# EasyEDA schematic 0004.json
TITLE: Sheet_1; REV: 1.0; Date: 2021-01-05; Sheet: 1/1; Company: Your Company
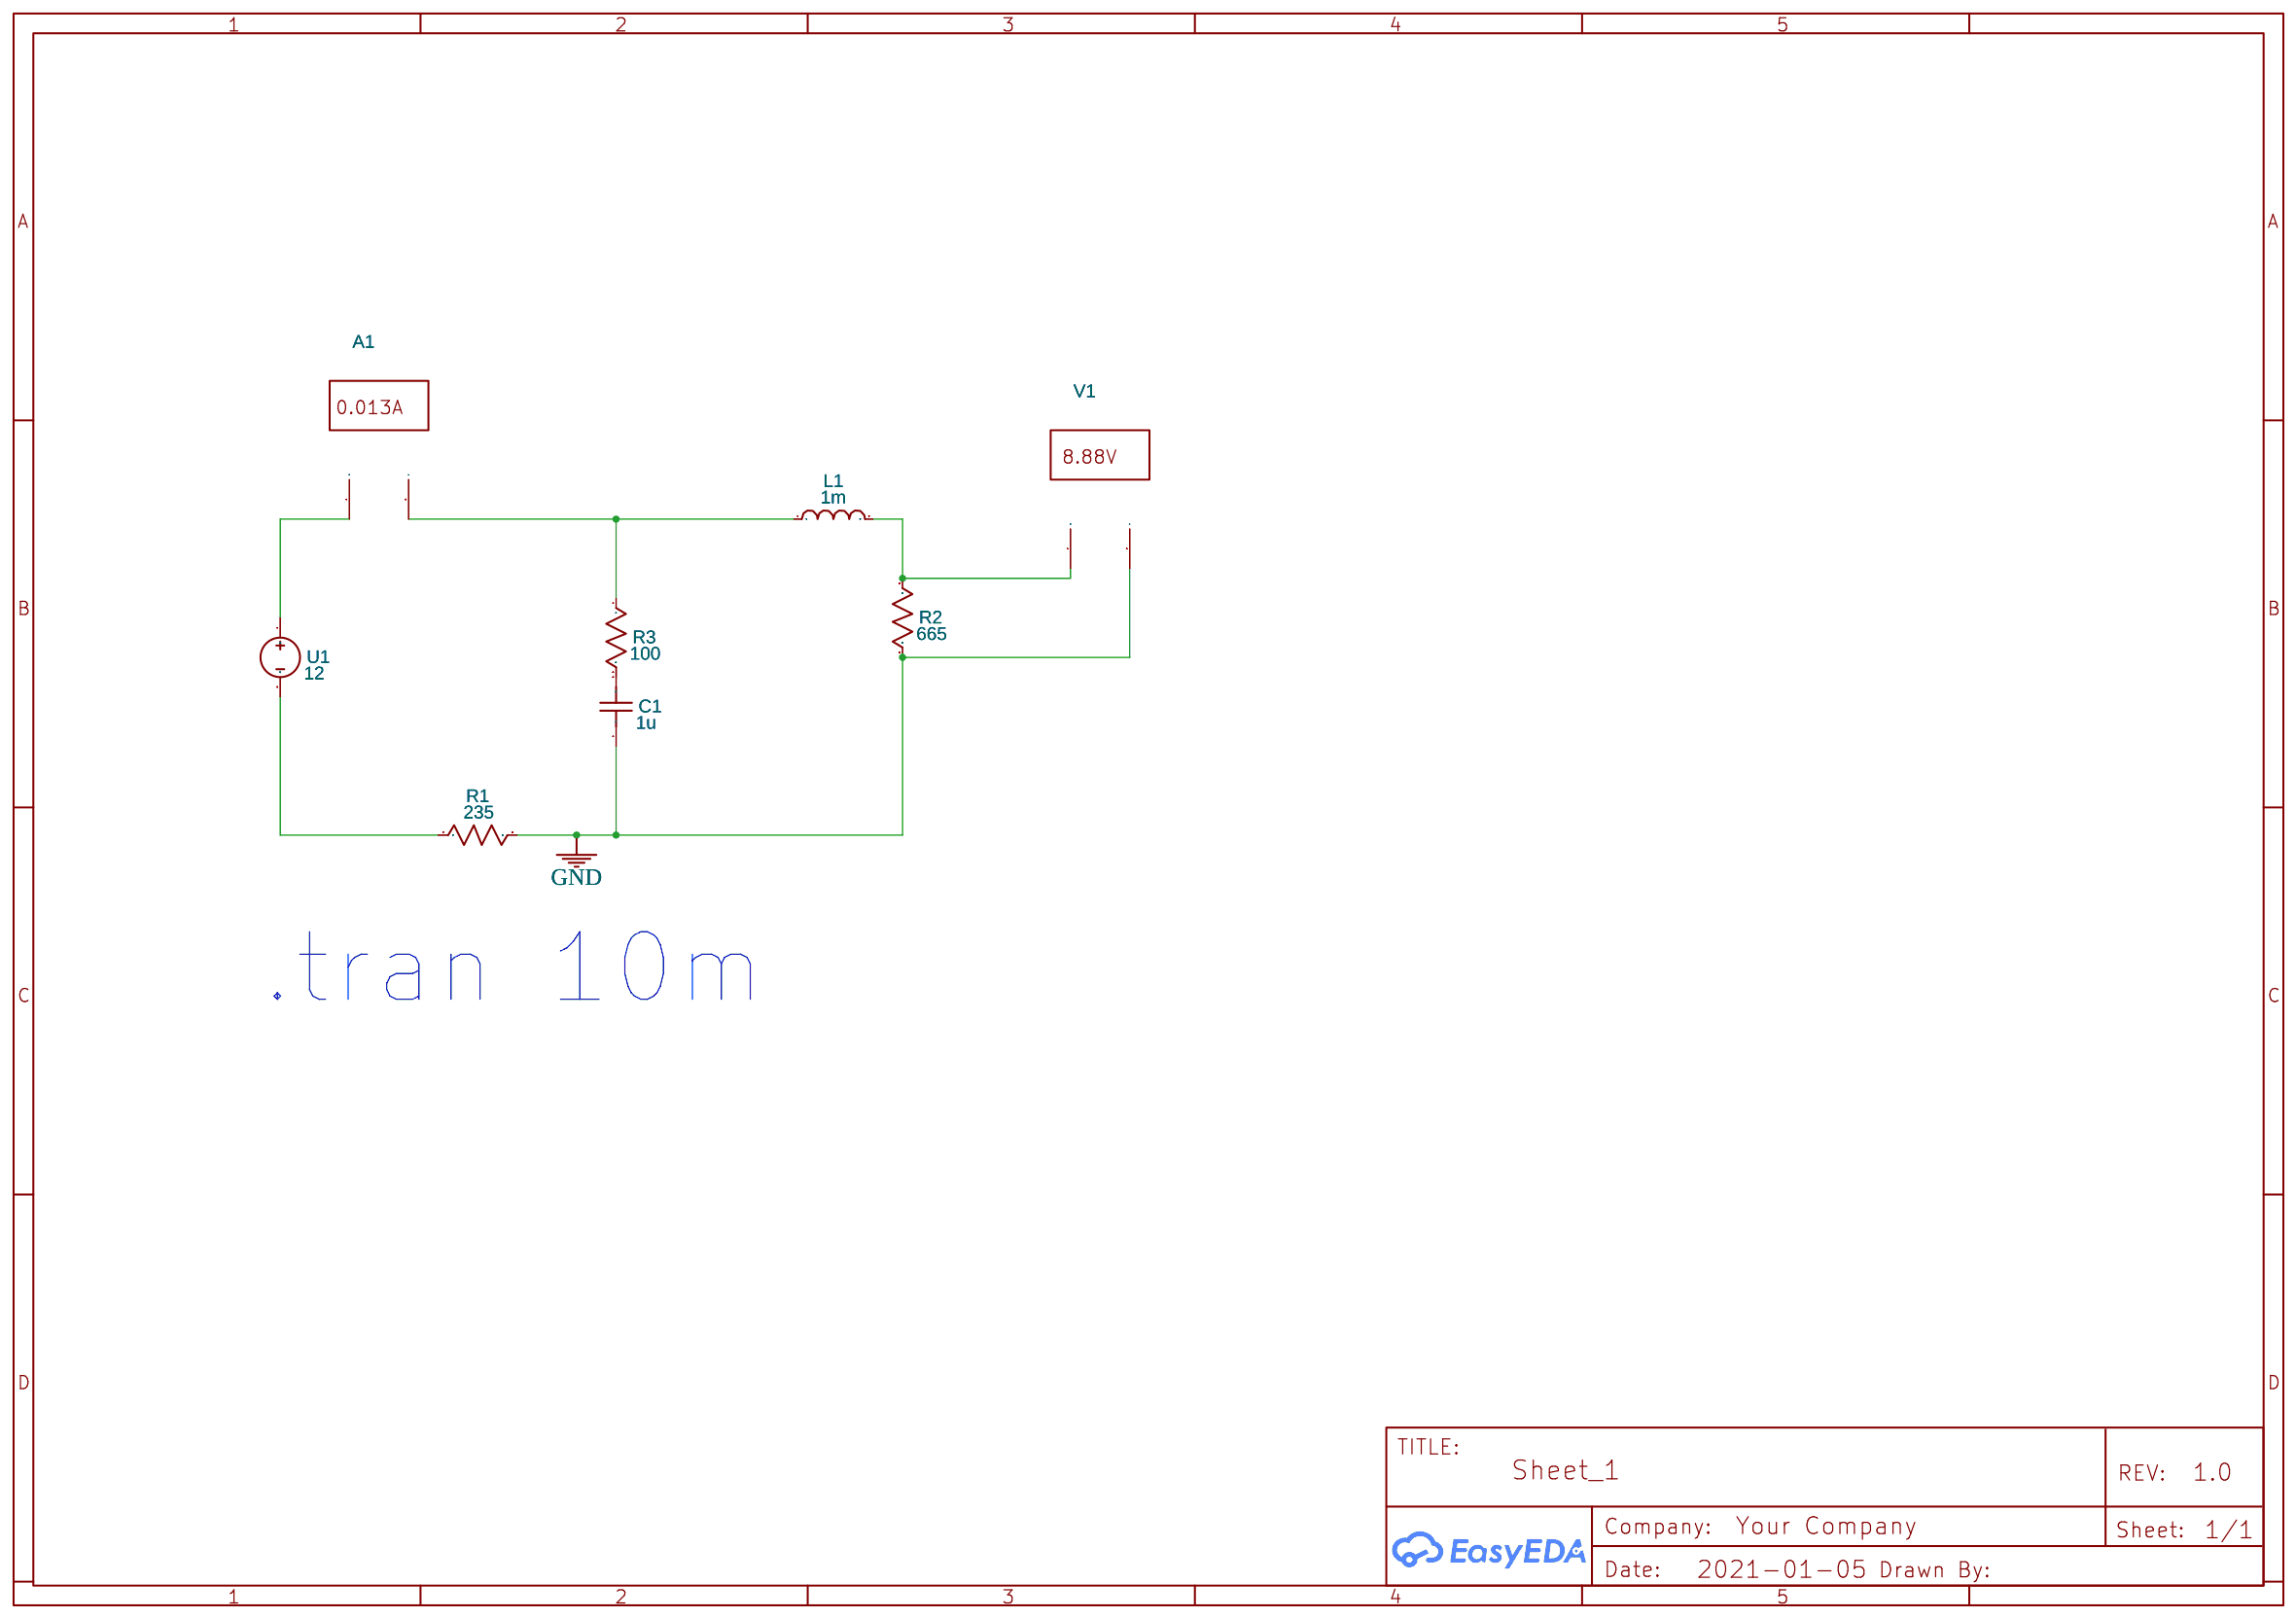
[diagram p0: schematic sheet]

## Parts
A1  Multimeter
C1  1u  [RAD-0.1]
L1  1m  [AXIAL-0.4]
R1  235  [AXIAL-0.3]
R2  665  [AXIAL-0.3]
R3  100  [AXIAL-0.3]
U1  12  [HDR1X2]
V1  Multimeter

## Library data of the parts
A1 = MULTIMETER: Supplier: LCSC; Multimeter Type: Amper; Power Type: AC; Voltmeter resistance: 10μ; Ammeter resistance: 1G; NameDisplay: 0; Contributor: EasyEDA; sim: true
C1 = Capacitor_US: Contributor: EasyEDA; Supplier: YUJING
L1 = Inductor: Supplier: YUJING; Contributor: EasyEDA
R1-R3 = Resistor_US: Resistance: 1k; Contributor: EasyEDA; Supplier: YUJING
U1 = VDC: Contributor: EasyEDA; sim: true
V1 = MULTIMETER: Supplier: LCSC; Multimeter Type: Voltmeter; Power Type: AC; Voltmeter resistance: 10μ; Ammeter resistance: 1G; NameDisplay: 0; Contributor: EasyEDA; sim: true

## Nets
GND: C1.1 R1.2 R2.2 V1.2(I)
Net-(A1-1): A1.1(+) U1.1
Net-(A1-2): A1.2(I) L1.1 R3.1
Net-(L1-2): L1.2 R2.1 V1.1(+)
Net-(R1-1): R1.1 U1.2

Not connected (* = marked no-connect by the designer): C1 2; R3 2

## Notes on the sheet
- .tran 10m
